# EAGLE design noise_lev_rev1 (EAGLE 9.0.0)
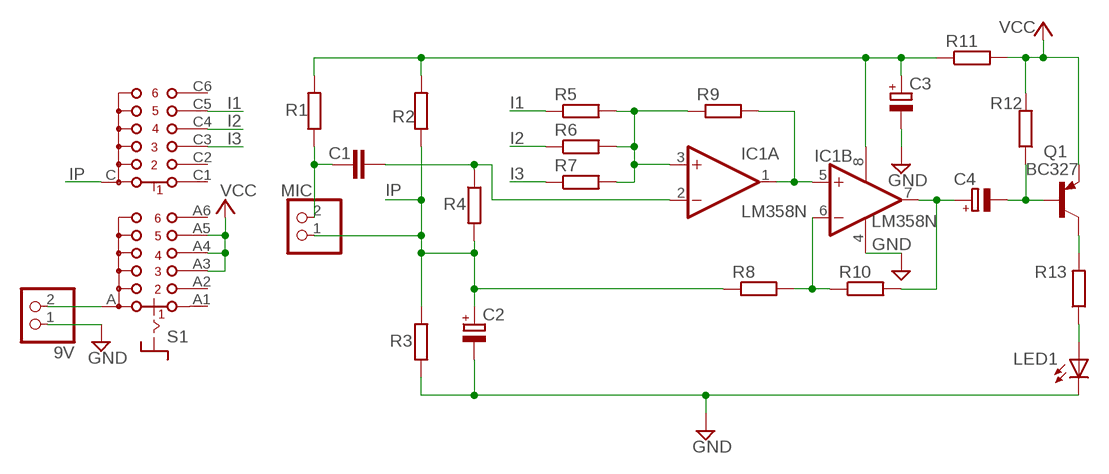
[diagram p0: schematic, sheet 1]

## Parts
9V  PINHD-1X2  [1X02]
C1  C-EU025-025X050  [C025-025X050]
C2  CPOL-EUE2.5-5  [E2,5-5]
C3  CPOL-EUE5-10.5  [E5-10,5]
C4  CPOL-EUE2.5-5  [E2,5-5]
IC1  LM358N  [DIL08]
LED1  LED5MM  [LED5MM]
MIC  PINHD-1X2  [1X02]
Q1  BC327  [TO92-EBC]
R1  R-EU_0207/10  [0207/10]
R2  R-EU_0207/10  [0207/10]
R3  R-EU_0207/10  [0207/10]
R4  R-EU_0207/10  [0207/10]
R5  R-EU_0207/10  [0207/10]
R6  R-EU_0207/10  [0207/10]
R7  R-EU_0207/10  [0207/10]
R8  R-EU_0207/10  [0207/10]
R9  R-EU_0207/10  [0207/10]
R10  R-EU_0207/10  [0207/10]
R11  R-EU_0207/10  [0207/10]
R12  R-EU_0207/10  [0207/10]
R13  R-EU_0207/10  [0207/10]
S1  CK102X06  [CK102X06]

## Nets
GND: 9V.1 C2.- C3.- IC1.4(P:V-) LED1.K(C) R3.1
I1: R5.1 S1.C5
I2: R6.1 S1.C4
I3: R7.1 S1.C3
IP: C2.+ MIC.1 R2.1 R3.2 R4.2 R8.1 S1.C
N$1: IC1.3(A:+IN) R5.2 R6.2 R7.2 R9.1
N$2: Q1.C R13.2
N$3: LED1.A R13.1
N$4: IC1.1(A:OUT) IC1.5(B:+IN) R9.2
N$5: C4.- Q1.B R12.1
N$7: 9V.2 S1.A
N$8: IC1.6(B:-IN) R8.2 R10.1
N$9: C1.2 IC1.2(A:-IN) R4.1
N$10: C1.1 MIC.2 R1.1
N$11: C4.+ IC1.7(B:OUT) R10.2
N$12: C3.+ IC1.8(P:V+) R1.2 R2.2 R11.1
VCC: Q1.E R11.2 R12.2 S1.A3 S1.A4 S1.A5
Unconnected: S1.A1 S1.A2 S1.A6 S1.C1 S1.C2 S1.C6

## Library data of the parts
9V MIC = pinhead:PINHD-1X2: PIN HEADER
C1 = rcl:C-EU: CAPACITOR, European symbol; SPICEPREFIX: C
C2-C4 = rcl:CPOL-EU: POLARIZED CAPACITOR, European symbol; SPICEPREFIX: C
IC1 = linear:LM358: OP AMP also LM158; LM258; LM2904 Source: http://cache.national.com/ds/LM/LM158.pdf
LED1 = led:LED: LED OSRAM: - CHIPLED LG R971, LG N971, LY N971, LG Q971, LY Q971, LO R971, LY R971 LH N974, LH R974 LS Q976, LO Q976, LY Q976 LO Q996 - Hyper CHIPLED LW Q18S LB Q993, LB Q99A, LB R99A - SideLED LS A670, LO A670, LY A670, LG A670, LP A670 LB A673, LV A673, LT A673, LW A673 LH A674 LY A675 LS A676, LA A676, LO A676, LY A676, LW A676 LS A679, LY A679, LG A679 - Hyper Micro SIDELED® LS Y876, LA Y876, LO Y876, LY Y876 LT Y87S - SmartLED LW L88C, LW L88S LB L89C, LB L89S, LG L890 LS L89K, LO L89K, LY L89K LS L896, LA L896, LO L896, LY L896 - TOPLED LS T670, LO T670, LY T670, LG T670, LP T670 LSG T670, LSP T670, LSY T670, LOP T670, LYG T670 LG T671, LOG T671, LSG T671 LB T673, LV T673, LT T673, LW T673 LH T674 LS T676, LA T676, LO T676, LY T676, LB T676, LH T676, LSB T676, LW T676 LB T67C, LV T67C, LT T67C, LS T67K, LO T67K, LY T67K, LW E67C LS E67B, LA E67B, LO E67B, LY E67B, LB E67C, LV E67C, LT E67C LW T67C LS T679, LY T679, LG T679 LS T770, LO T770, LY T770, LG T770, LP T770 LB T773, LV T773, LT T773, LW T773 LH T774 LS E675, LA E675, LY E675, LS T675 LS T776, LA T776, LO T776, LY T776, LB T776 LHGB T686 LT T68C, LB T68C - Hyper Mini TOPLED® LB M676 - Mini TOPLED Santana® LG M470 LS M47K, LO M47K, LY M47K Source: http://www.osram.convergy.de LUXEON: - LUMILED® LXK2-PW12-R00, LXK2-PW12-S00, LXK2-PW14-U00, LXK2-PW14-V00 LXK2-PM12-R00, LXK2-PM12-S00, LXK2-PM14-U00 LXK2-PE12-Q00, LXK2-PE12-R00, LXK2-PE12-S00, LXK2-PE14-T00, LXK2-PE14-U00 LXK2-PB12-K00, LXK2-PB12-L00, LXK2-PB12-M00, LXK2-PB14-N00, LXK2-PB14-P00, LXK2-PB14-Q00 LXK2-PR12-L00, LXK2-PR12-M00, LXK2-PR14-Q00, LXK2-PR14-R00 LXK2-PD12-Q00, LXK2-PD12-R00, LXK2-PD12-S00 LXK2-PH12-R00, LXK2-PH12-S00 LXK2-PL12-P00, LXK2-PL12-Q00, LXK2-PL12-R00 Source: www.luxeon.com KINGBRIGHT: KA-3528ASYC Source: www.kingbright.com
Q1 = transistor-pnp:BC327*: PNP Transistror
R1-R13 = rcl:R-EU_: RESISTOR, European symbol; SPICEPREFIX: R
S1 = switch:CK102X06: ROTARY SWITCH C&K

## Board
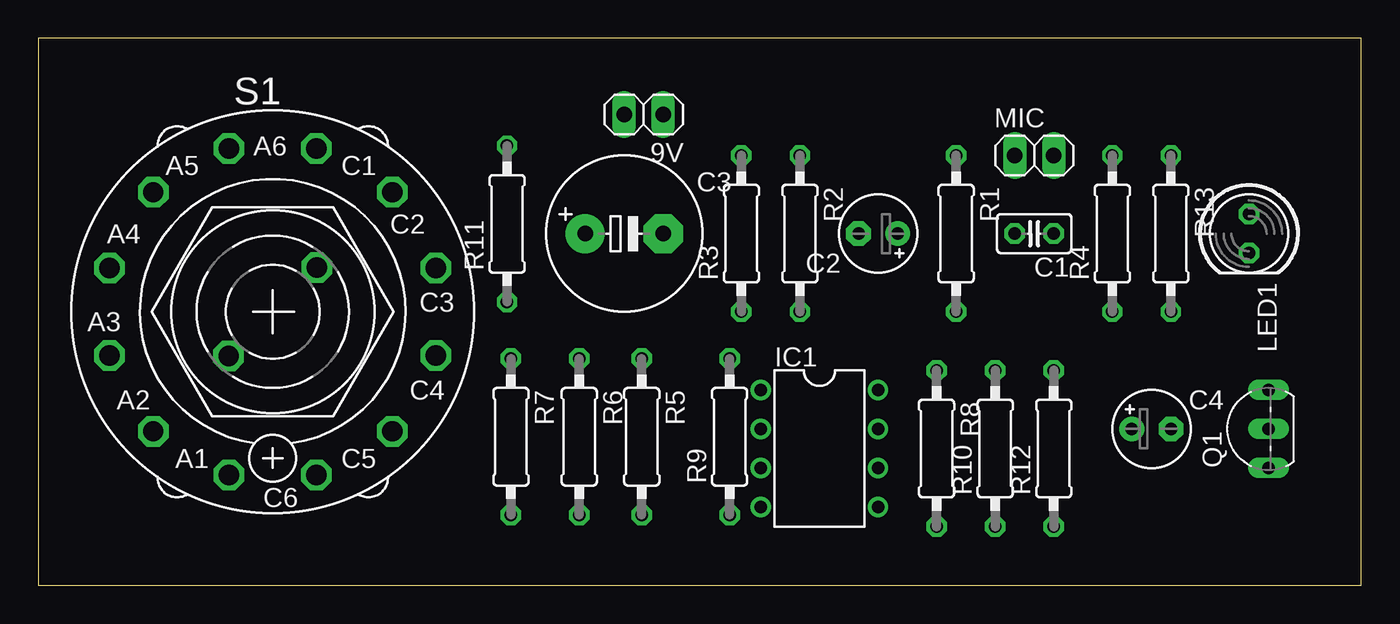
[diagram p1: board, top side]
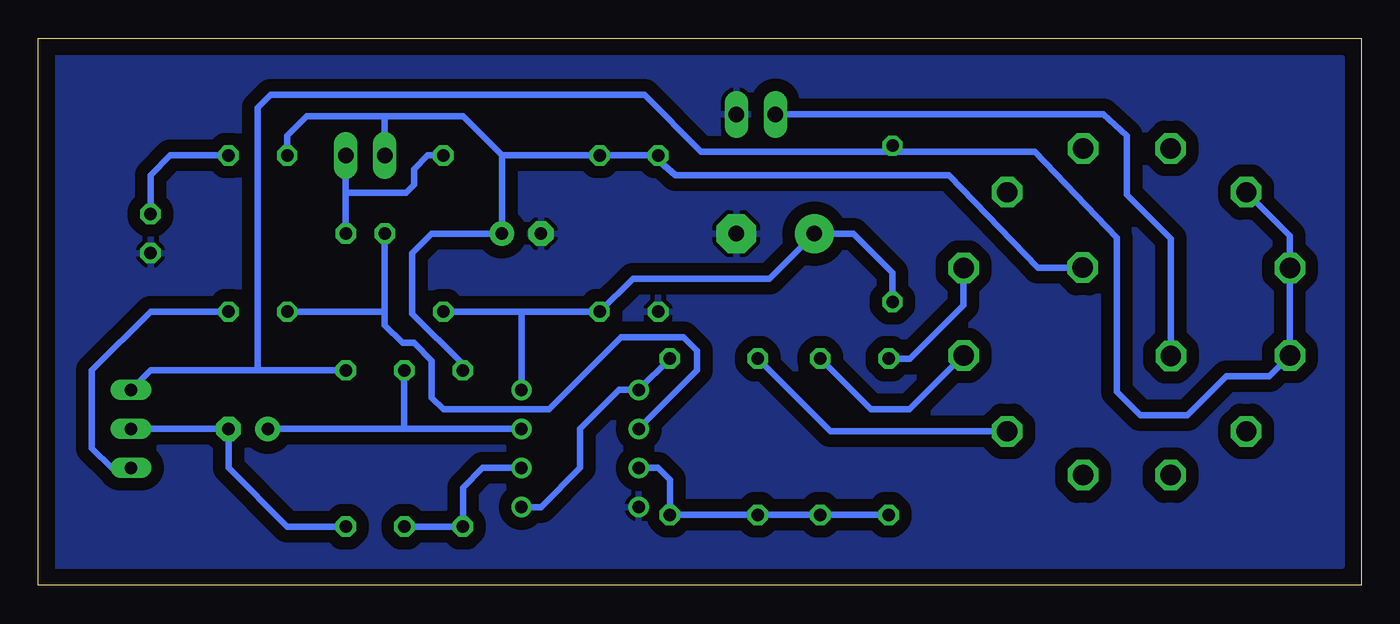
[diagram p2: board, bottom side, seen from below]

Size 86.03 x 35.55 mm. Coordinates in mm from the lower left corner, seen from the top.
Outline: 0,0 86.03,0 86.03,35.55 0,35.55 0,0
Copper layers (1*16): Top 0.035mm / dielectric 1.5mm / Bottom 0.035mm
Design rules "default": minimum track width 6mil, minimum drill 0.35mm, track to track 6mil, track to pad 6mil, pad to pad 6mil, via to via 6mil, smd to smd 6mil, copper to edge 40mil, drill to drill 6mil, minimum pad ring 10mil, minimum via ring 8mil, stop-mask expansion 4mil, vias tented up to drill 0mil, thermal gap 10mil

### Footprints (pad centres in the part's own frame; a part is rotated, then mirrored left to right if it is on the bottom)
1X02 = drill 1.016 long: 1 -1.27,0; 2 1.27,0
C025-025X050 = drill 0.813 octagon: 1 -1.27,0; 2 1.27,0
E2,5-5 = drill 0.813 pad 1.6: + -1.27,0 | drill 0.813 pad 1.6 octagon: - 1.27,0
E5-10,5 = drill 1.016 pad 2.54: + -2.54,0 | drill 1.016 pad 2.54 octagon: - 2.54,0
DIL08 = drill 0.813 pad 1.27: 1 -3.81,-3.81; 2 -1.27,-3.81; 3 1.27,-3.81; 4 3.81,-3.81; 5 3.81,3.81; 6 1.27,3.81; 7 -1.27,3.81; 8 -3.81,3.81
LED5MM = drill 0.813 octagon: A -1.27,0; K 1.27,0
TO92-EBC = drill 0.813 long: B 0,-1.27; C -2.54,-1.27; E 2.54,-1.27
0207/10 = drill 0.813 octagon: 1 -5.08,0; 2 5.08,0
CK102X06 = drill 1.321 octagon: A -2.87,-2.87; A1 -2.845,-10.617; A2 -7.772,-7.772; A3 -10.617,-2.845; A4 -10.617,2.845; A5 -7.772,7.772; A6 -2.845,10.617; C 2.87,2.87; C1 2.845,10.617; C2 7.772,7.772; C3 10.617,2.845; C4 10.617,-2.845; C5 7.772,-7.772; C6 2.845,-10.617

### Placement (x,y rotation side)
9V  39.37,30.61 180 top
C1  64.77,22.86 180 top
C2  54.61,22.86 180 top
C3  38.1,22.86 0 top
C4  72.39,10.16 0 top
IC1  50.8,8.89 270 top
LED1  78.74,22.86 270 top
MIC  64.77,27.94 0 top
Q1  78.74,10.16 90 top
R1  59.69,22.86 270 top
R2  49.53,22.86 270 top
R3  45.72,22.86 90 top
R4  69.85,22.86 90 top
R5  39.24,9.65 270 top
R6  35.18,9.65 270 top
R7  30.73,9.65 270 top
R8  58.42,8.89 270 top
R9  44.96,9.65 90 top
R10  62.23,8.89 90 top
R11  30.48,23.49 90 top
R12  66.04,8.89 90 top
R13  73.66,22.86 270 top
S1  15.24,17.78 0 top

### Tracks (layer width: path | path; a pad name or v marks a point on that pad's centre or on a via)
GND
  pour Bottom (isolate 0.813): 1.27,34.29 85.09,34.29 85.09,1.27 1.27,1.27
I1
  Bottom 0.406: S1.C5 34.52,10.01 R5.1
I2
  Bottom 0.406: S1.C4 29.36,11.43 31.88,11.43 R6.1
I3
  Bottom 0.406: S1.C3 25.86,18.21 29.34,14.73 R7.1
IP
  Bottom 0.406: 46.1,27.94 R2.1 55.88,27.94 | R3.2 46.1,27.94 | 55.88,27.94 C2.+ 60.45,22.86 61.72,21.59 61.72,17.65 58.42,14.35 R8.1 | R4.2 69.85,29.21 68.58,30.48 63.5,30.48 | 63.5,30.48 58.42,30.48 55.88,27.94 | MIC.1 63.5,30.48 | S1.C 21.03,20.65 26.8,26.67 44.58,26.67 46.1,27.94
N$1
  Bottom 0.406: R7.2 R6.2 R5.2 R9.1 44.96,6.86 45.72,7.62 IC1.3
N$2
  Bottom 0.406: R13.2 78.74,17.78 82.55,13.97 82.55,8.89 81.28,7.62 Q1.C
N$3
  Bottom 0.406: LED1.A 78.74,26.67 77.47,27.94 R13.1
N$4
  Bottom 0.406: R9.2 IC1.1 48.26,12.7 50.8,10.16 50.8,7.62 53.34,5.08 IC1.5
N$5
  Bottom 0.406: Q1.B C4.- 73.66,7.62 69.85,3.81 R12.1
N$7
  Bottom 0.406: S1.A 12.37,22.53 15.24,25.4 15.24,29.21 16.76,30.61 9V.2
N$8
  Bottom 0.406: R10.1 R8.2 58.42,6.35 57.15,7.62 IC1.6
N$9
  Bottom 0.406: 63.5,17.78 C1.2 | R4.1 63.5,17.78 | 63.5,17.78 63.5,16.89 62.36,15.75 61.6,15.75 60.45,14.61 60.45,12.19 59.69,11.43 52.83,11.43 48.13,16.13 44.07,16.13 43.18,15.24 43.18,13.97 IC1.2
N$10
  Bottom 0.406: R1.1 60.71,27.94 61.6,27.05 61.6,26.04 62.1,25.53 66.04,25.53 | 66.04,25.53 MIC.2 | 66.04,25.53 C1.1
N$11
  Bottom 0.406: 62.23,10.16 C4.+ | IC1.7 62.23,10.16 | R10.2 62.23,10.16
N$12
  Bottom 0.406: R11.1 30.48,20.32 33.02,22.86 C3.+ 38.48,19.94 47.37,19.94 R2.2 54.61,17.78 | 54.61,17.78 R1.2 | IC1.8 54.61,17.78
VCC
  Bottom 0.406: S1.A5 4.62,22.71 S1.A4 S1.A3 5.97,13.59 8.76,13.59 11.3,11.05 14.35,11.05 15.88,12.57 15.88,22.61 21.21,28.19 30.61,28.19 | R12.2 71.75,13.97 | 71.75,13.97 78.74,13.97 Q1.E | 71.75,13.97 71.75,31.05 70.93,31.88 46.61,31.88 42.93,28.19 30.61,28.19 | R11.2 30.61,28.19